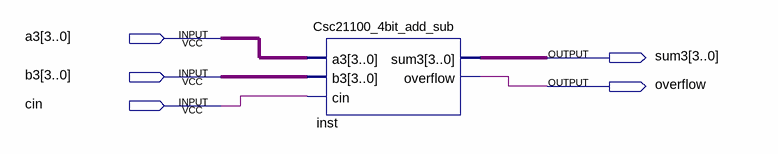
[diagram p0: schematic sheet]
// Quartus schematic Block.bdf as structural Verilog: 1 symbols, 5 pins
module Block (
  input  [3:0] a3,
  input  [3:0] b3,
  input  cin,
  output [3:0] sum3,
  output overflow
);

  Csc21100_4bit_add_sub inst (.a3(a3), .b3(b3), .cin(cin), .sum3(sum3), .overflow(overflow));
endmodule
